# EAGLE design TaHTestbed (EAGLE 6.5.0)
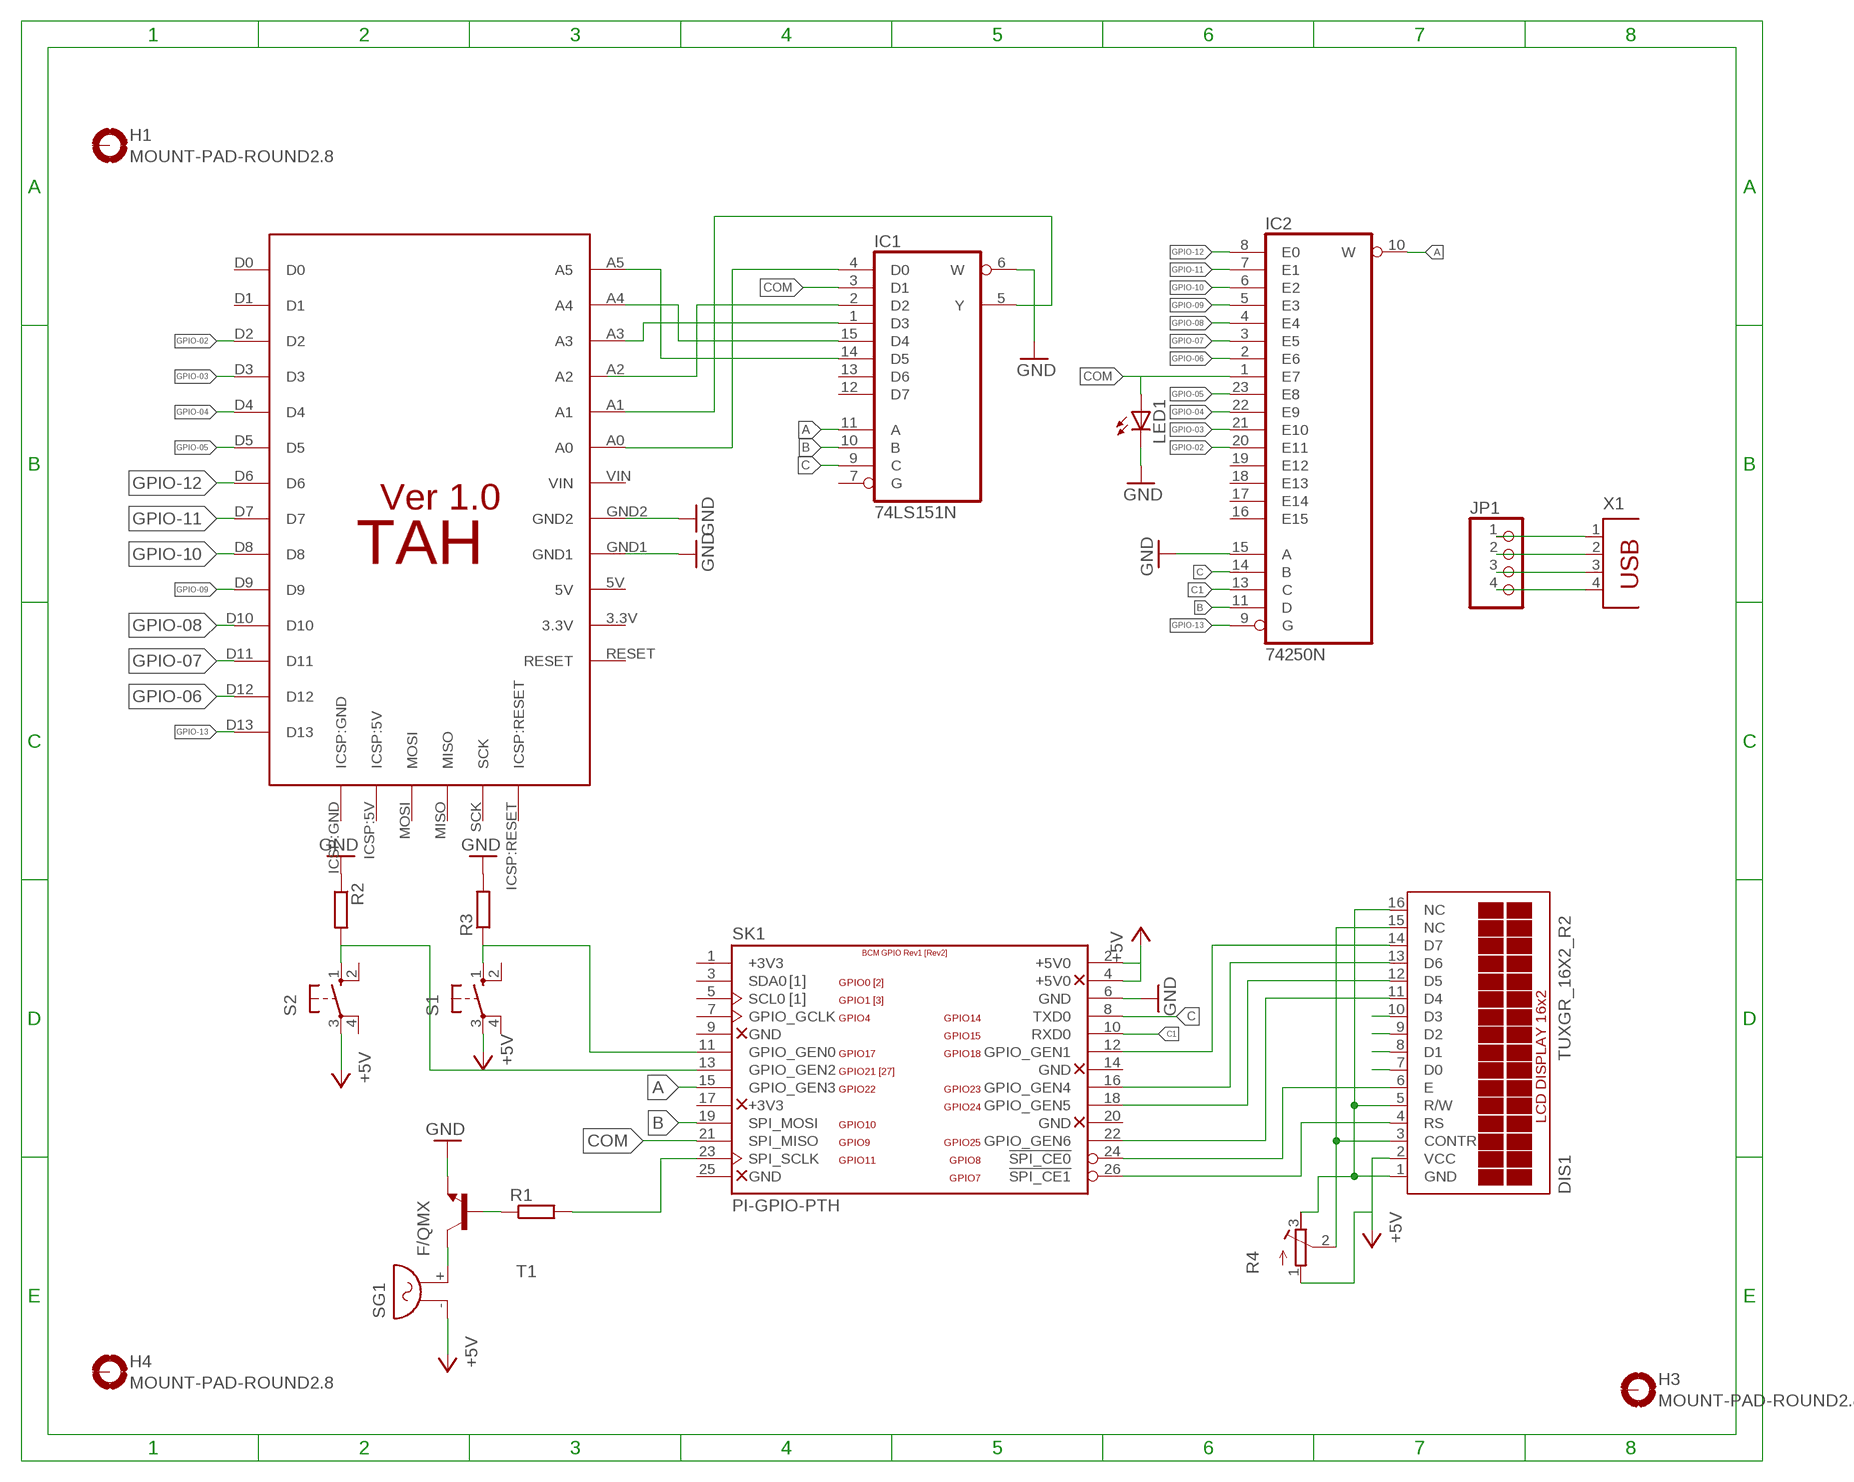
[diagram p0: schematic, sheet 1]

## Parts
DIS1  TUXGR_16X2_R2  [TUXGR_16X2_R2]
H1  MOUNT-PAD-ROUND2.8  [2,8-PAD]
H3  MOUNT-PAD-ROUND2.8  [2,8-PAD]
H4  MOUNT-PAD-ROUND2.8  [2,8-PAD]
IC1  74LS151N  [DIL16]
IC2  74250N  [DIL24-6]
JP1  PINHD-1X4  [1X04]
LED1  LEDCHIPLED_1206  [CHIPLED_1206]
R1  R-EU_0207/10  [0207/10]
R2  R-EU_0613/5V  [P0613V]
R3  R-EU_0613/5V  [P0613V]
R4  R-TRIMM64Z  [RTRIM64Z]
S1  10-XX  [B3F-10XX]
S2  10-XX  [B3F-10XX]
SG1  F/QMX  [F/QMX]
SK1  PI-GPIO-PTH  [GPIO-CONNECTOR]
T1  BC547-NPN-TO92-CBE  [TO92-CBE]
U$2  TAH_FOOTPRINT_VER1.0  [TAH_FOOTPRINT]
X1  PN87520  [PN87520]

## Nets
+5V: DIS1.2(VCC) R4.1(A) S1.3(P) S2.3(P) SG1.- SK1.2(+5V0) SK1.4(+5V0)
A: IC1.11(A) IC2.10(W) SK1.15(GPIO_GEN3)
B: IC1.10(B) IC2.11(D) SK1.19(SPI_MOSI)
C: IC1.9(C) IC2.14(B) SK1.8(TXD0)
C1: IC2.13(C) SK1.10(RXD0)
CM_IN: IC1.4(D0) U$2.A0
COM: IC1.3(D1) IC2.1(E7) LED1.A SK1.21(SPI_MISO)
GND: IC1.6(W) IC2.15(A) LED1.C R2.1 R3.2 SK1.6(GND) T1.E U$2.GND1 U$2.GND2
GPIO-02: IC2.20(E11) U$2.D2
GPIO-03: IC2.21(E10) U$2.D3
GPIO-04: IC2.22(E9) U$2.D4
GPIO-05: IC2.23(E8) U$2.D5
GPIO-06: IC2.2(E6) U$2.D12
GPIO-07: IC2.3(E5) U$2.D11
GPIO-08: IC2.4(E4) U$2.D10
GPIO-09: IC2.5(E3) U$2.D9
GPIO-10: IC2.6(E2) U$2.D8
GPIO-11: IC2.7(E1) U$2.D7
GPIO-12: IC2.8(E0) U$2.D6
GPIO-13: IC2.9(G) U$2.D13
N$1: IC1.14(D5) U$2.A5
N$2: IC1.15(D4) U$2.A4
N$3: IC1.1(D3) U$2.A3
N$4: DIS1.4(RS) SK1.26(!SPI_CE1)
N$5: IC1.2(D2) U$2.A2
N$6: DIS1.6(E) SK1.24(!SPI_CE0)
N$7: DIS1.7(D0)
N$8: DIS1.8(D1)
N$9: DIS1.9(D2)
N$10: DIS1.10(D3)
N$11: DIS1.11(D4) SK1.22(GPIO_GEN6)
N$12: DIS1.12(D5) SK1.18(GPIO_GEN5)
N$13: DIS1.13(D6) SK1.16(GPIO_GEN4)
N$14: DIS1.14(D7) SK1.12(GPIO_GEN1)
N$15: JP1.1 X1.1
N$16: IC1.5(Y) U$2.A1
N$17: DIS1.1(GND) DIS1.5(R/W) DIS1.16(NC) R4.3(E)
N$18: R1.2 SK1.23(SPI_SCLK)
N$19: R1.1 T1.B
N$20: DIS1.3(CONTR) DIS1.15(NC) R4.2(S)
N$21: SG1.+ T1.C
N$22: R3.1 S1.1(S) SK1.11(GPIO_GEN0)
N$23: R2.2 S2.1(S) SK1.13(GPIO_GEN2)
N$25: JP1.2 X1.2
N$26: JP1.3 X1.3
N$27: JP1.4 X1.4
Unconnected: H1.B2,8(MOUNT) H3.B2,8(MOUNT) H4.B2,8(MOUNT) IC1.7(G) IC1.12(D7) IC1.13(D6) IC2.16(E15) IC2.17(E14) IC2.18(E13) IC2.19(E12) S1.2(S1) S1.4(P1) S2.2(S1) S2.4(P1) SK1.3(SDA0) SK1.5(SCL0) SK1.7(GPIO_GCLK) SK1.9(GND) SK1.14(GND) SK1.17(+3V3) SK1.20(GND) SK1.25(GND) U$2.3.3V U$2.5V U$2.D0 U$2.D1 U$2.ICSP:5V U$2.ICSP:GND U$2.ICSP:RESET U$2.MISO U$2.MOSI U$2.RESET U$2.SCK U$2.VIN

## Power pins joined to a net without a drawn wire
+3V3: SK1.1(+3V3)
GND: IC1.8(GND) IC2.12(GND)
VCC: IC1.16(VCC) IC2.24(VCC)

## Library data of the parts
DIS1 = display-lcd:TUXGR_16X2_R2: Tuxgraphics LCD display 16x2 characters reflective, without background light Source: tuxgr_12x2_r2.pdf; OC_FARNELL: unknown; OC_NEWARK: unknown
H1 H3 H4 = holes:MOUNT-PAD-ROUND: MOUNTING PAD, round
IC1 = 74xx-eu:74*151: Data SELECTOR/MULTIPLEXER
IC2 = 74xx-eu:74*250: 1 of 16 data GENERATOR/MULTIPLEXER, 3-state
JP1 = pinhead:PINHD-1X4: PIN HEADER
LED1 = led:LED: LED OSRAM: - CHIPLED LG R971, LG N971, LY N971, LG Q971, LY Q971, LO R971, LY R971 LH N974, LH R974 LS Q976, LO Q976, LY Q976 LO Q996 - Hyper CHIPLED LW Q18S LB Q993, LB Q99A, LB R99A - SideLED LS A670, LO A670, LY A670, LG A670, LP A670 LB A673, LV A673, LT A673, LW A673 LH A674 LY A675 LS A676, LA A676, LO A676, LY A676, LW A676 LS A679, LY A679, LG A679 - Hyper Micro SIDELED® LS Y876, LA Y876, LO Y876, LY Y876 LT Y87S - SmartLED LW L88C, LW L88S LB L89C, LB L89S, LG L890 LS L89K, LO L89K, LY L89K LS L896, LA L896, LO L896, LY L896 - TOPLED LS T670, LO T670, LY T670, LG T670, LP T670 LSG T670, LSP T670, LSY T670, LOP T670, LYG T670 LG T671, LOG T671, LSG T671 LB T673, LV T673, LT T673, LW T673 LH T674 LS T676, LA T676, LO T676, LY T676, LB T676, LH T676, LSB T676, LW T676 LB T67C, LV T67C, LT T67C, LS T67K, LO T67K, LY T67K, LW E67C LS E67B, LA E67B, LO E67B, LY E67B, LB E67C, LV E67C, LT E67C LW T67C LS T679, LY T679, LG T679 LS T770, LO T770, LY T770, LG T770, LP T770 LB T773, LV T773, LT T773, LW T773 LH T774 LS E675, LA E675, LY E675, LS T675 LS T776, LA T776, LO T776, LY T776, LB T776 LHGB T686 LT T68C, LB T68C - Hyper Mini TOPLED® LB M676 - Mini TOPLED Santana® LG M470 LS M47K, LO M47K, LY M47K Source: http://www.osram.convergy.de LUXEON: - LUMILED® LXK2-PW12-R00, LXK2-PW12-S00, LXK2-PW14-U00, LXK2-PW14-V00 LXK2-PM12-R00, LXK2-PM12-S00, LXK2-PM14-U00 LXK2-PE12-Q00, LXK2-PE12-R00, LXK2-PE12-S00, LXK2-PE14-T00, LXK2-PE14-U00 LXK2-PB12-K00, LXK2-PB12-L00, LXK2-PB12-M00, LXK2-PB14-N00, LXK2-PB14-P00, LXK2-PB14-Q00 LXK2-PR12-L00, LXK2-PR12-M00, LXK2-PR14-Q00, LXK2-PR14-R00 LXK2-PD12-Q00, LXK2-PD12-R00, LXK2-PD12-S00 LXK2-PH12-R00, LXK2-PH12-S00 LXK2-PL12-P00, LXK2-PL12-Q00, LXK2-PL12-R00 Source: www.luxeon.com KINGBRIGHT: KA-3528ASYC Source: www.kingbright.com
R1-R3 = rcl:R-EU_: RESISTOR, European symbol
R4 = rcl:R-TRIMM: Trimm resistor
S1 S2 = switch-omron:10-XX: OMRON SWITCH; MPN: B3F-1000; OC_FARNELL: 176432; OC_NEWARK: 36M3542
SG1 = buzzer:F/QMX: BUZZER Source: Buerklin; OC_FARNELL: unknown; OC_NEWARK: unknown
SK1 = Raspberry-pi:PI-: Raspberry Pi
T1 = transistor:*-NPN-: NPN Transistror BF959 corrected 2008.03.06
U$2 = TAHNew:TAH_FOOTPRINT_VER1.0
X1 = con-berg:PN87520: BERG USB connector; OC_FARNELL: unknown; OC_NEWARK: unknown

## Board
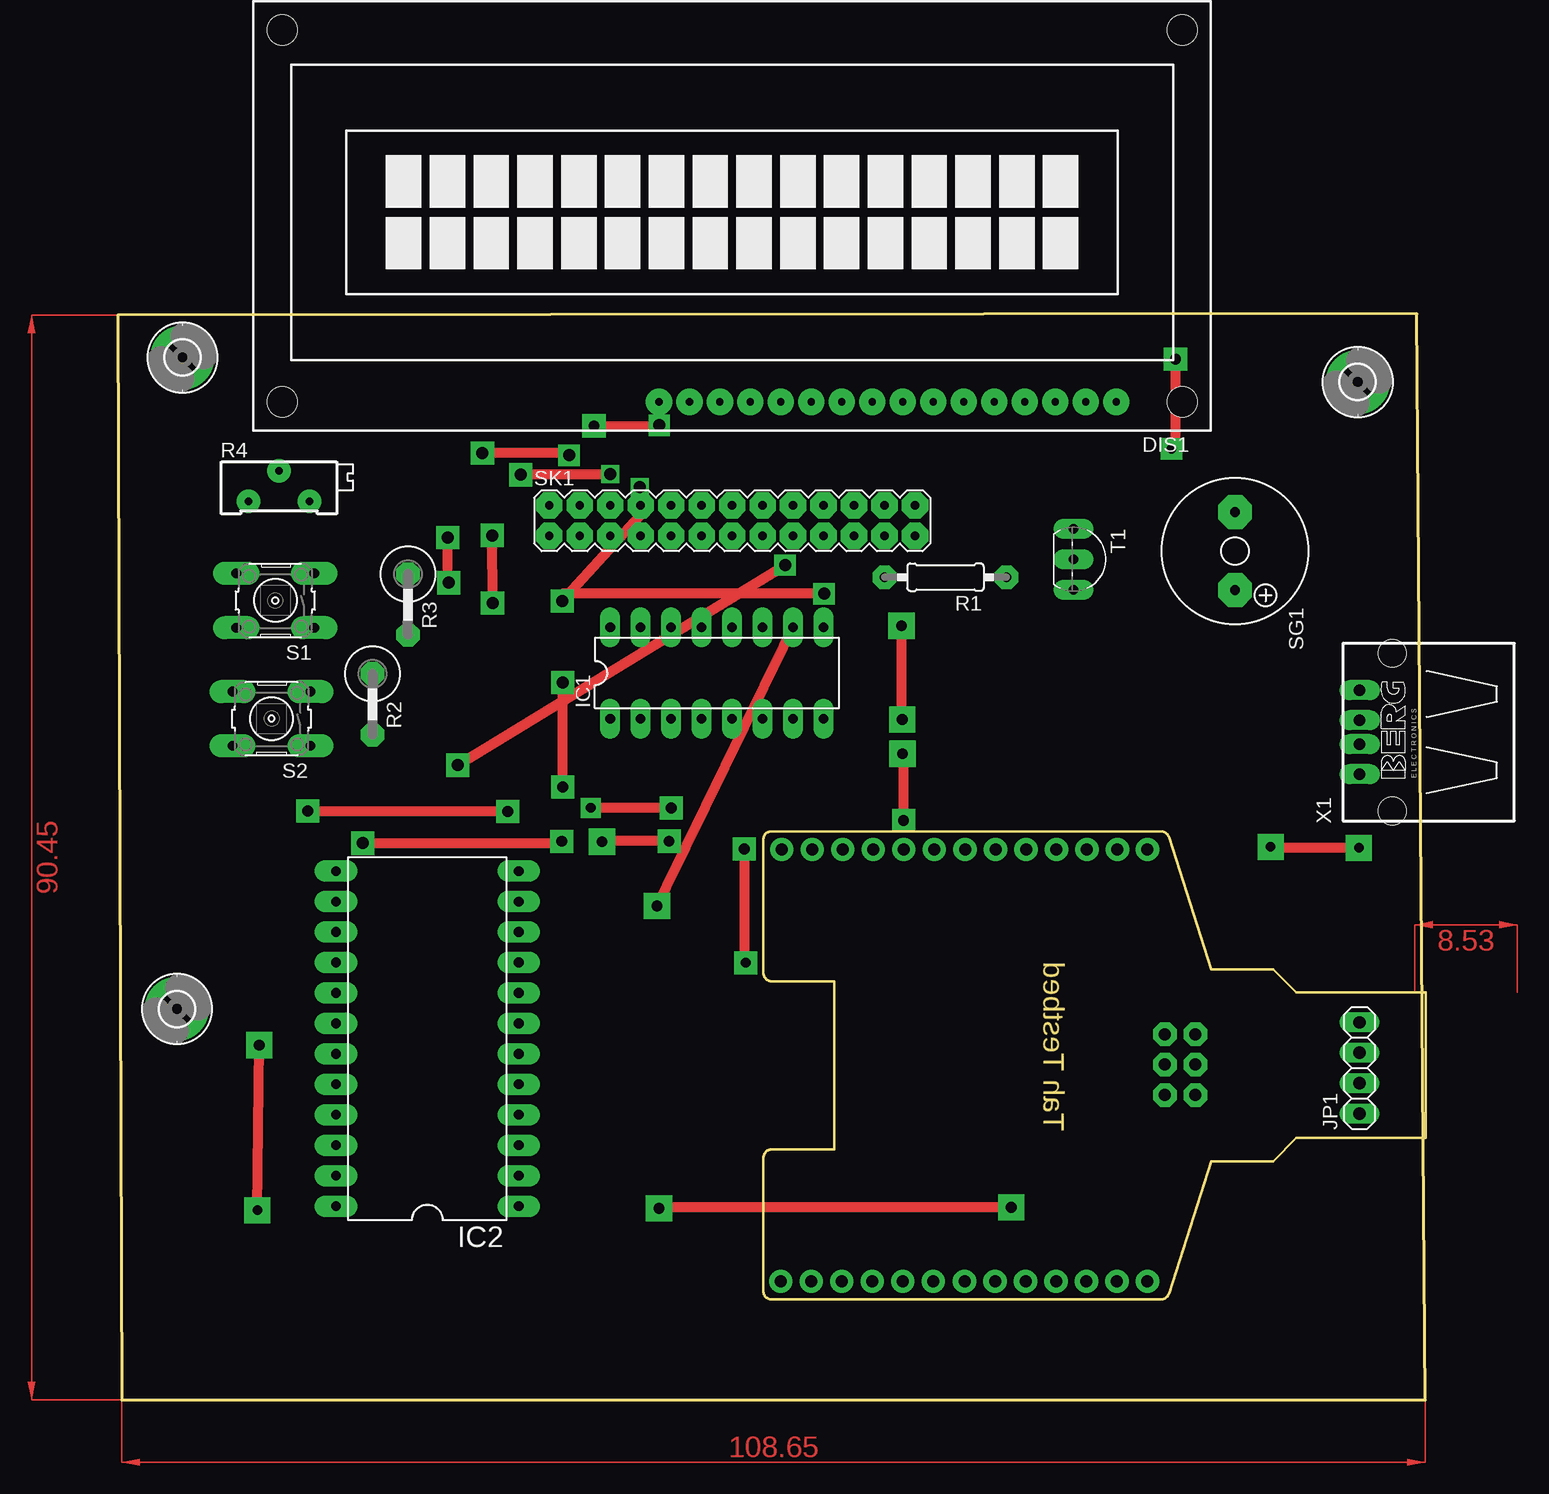
[diagram p1: board, top side]
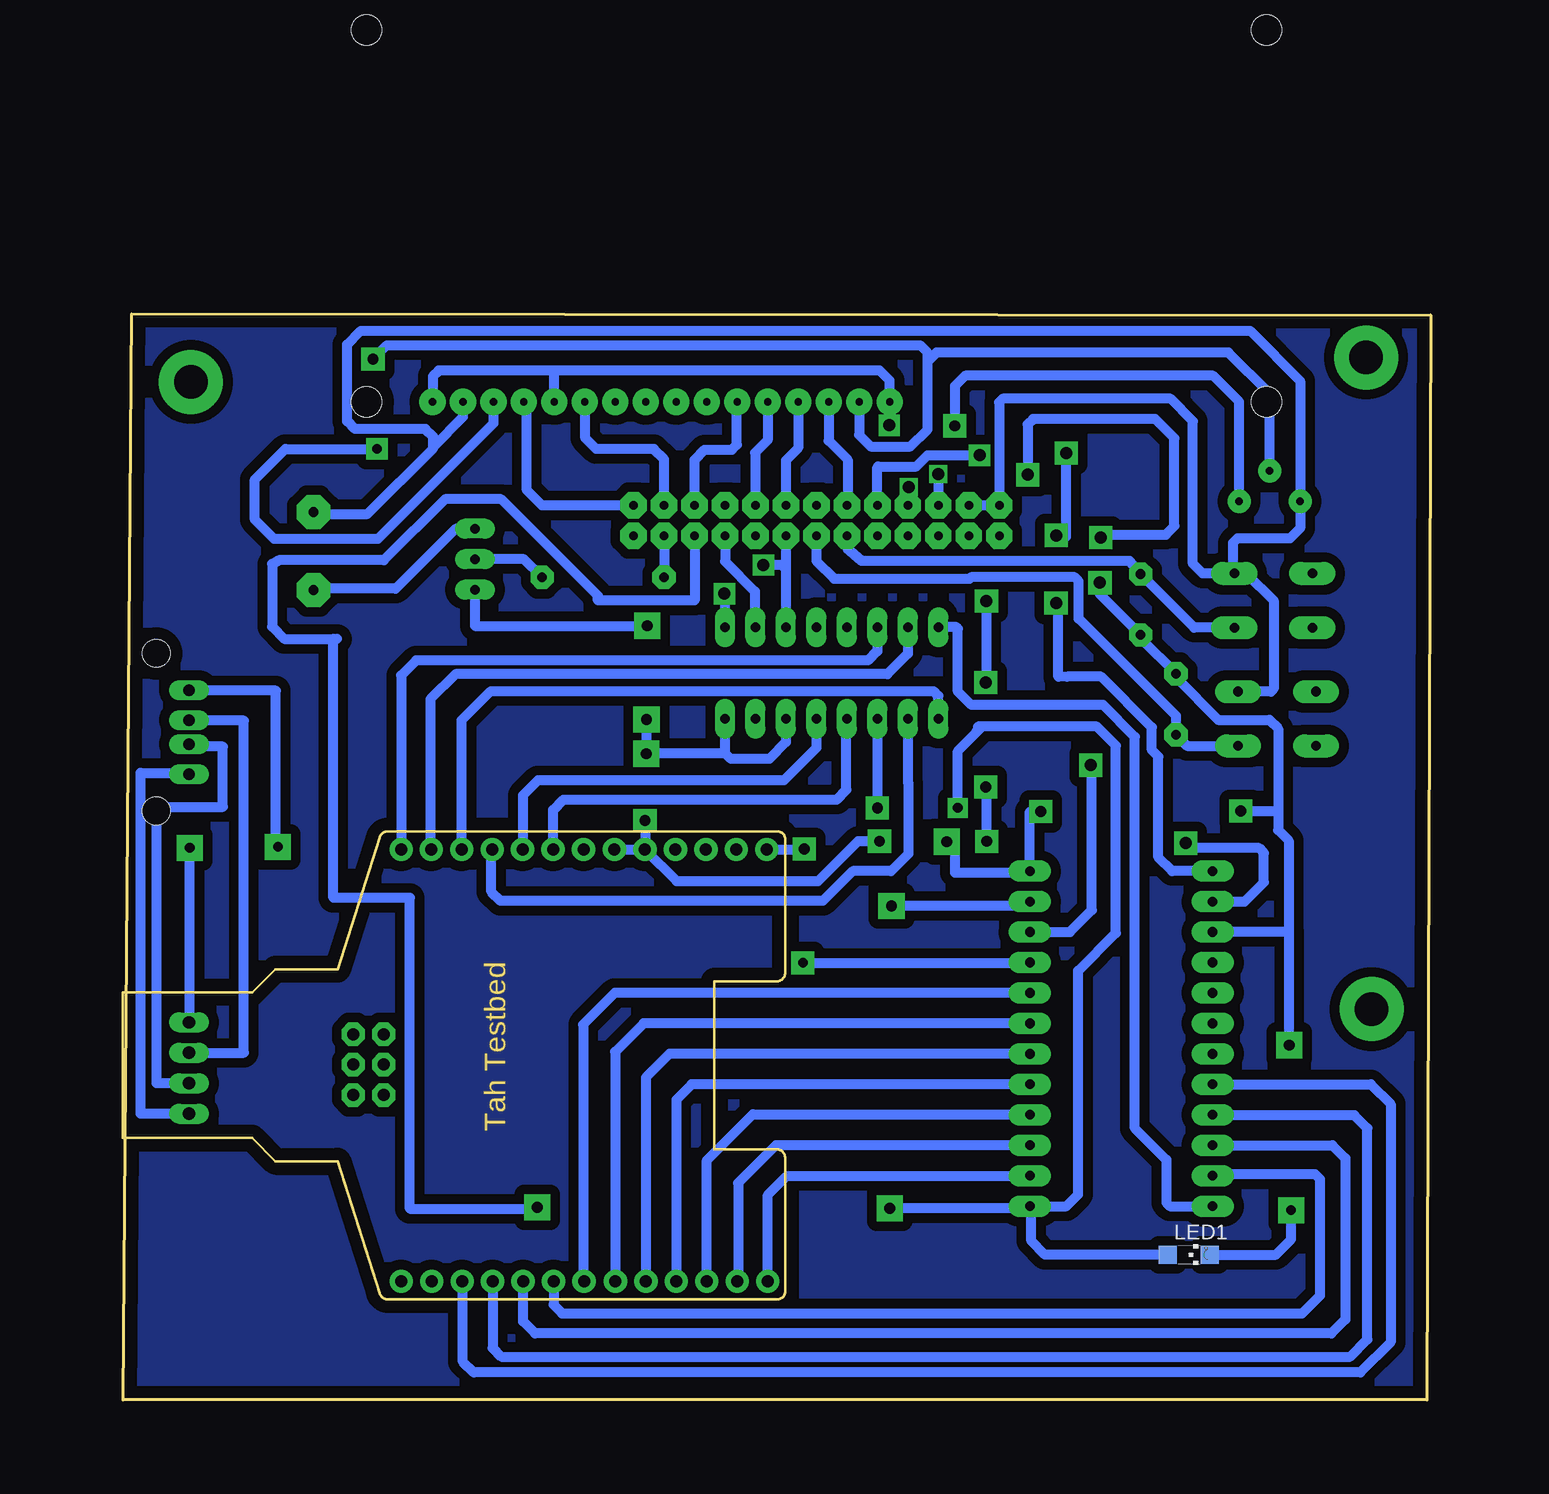
[diagram p2: board, bottom side, seen from below]

Size 109.01 x 90.54 mm. Coordinates in mm from the lower left corner, seen from the top.
Outline: 0.31,0 108.96,0.01 108.25,90.54 0,90.45 0.31,0
Copper layers (1*16): Top 0.035mm / dielectric 1.5mm / Bottom 0.035mm
Design rules "default": minimum track width 10mil, minimum drill 24mil, track to track 8mil, track to pad 8mil, pad to pad 8mil, via to via 8mil, smd to smd 8mil, copper to edge 40mil, drill to drill 8mil, minimum pad ring 10mil, minimum via ring 8mil, stop-mask expansion 4mil, vias tented up to drill 0mil, thermal gap 10mil

### Footprints (pad centres in the part's own frame; a part is rotated, then mirrored left to right if it is on the bottom)
TUXGR_16X2_R2 = drill 0.6 pad 2.184: 1 -32,15.5; 2 -29.46,15.5; 3 -26.92,15.5; 4 -24.38,15.5; 5 -21.84,15.5; 6 -19.3,15.5; 7 -16.76,15.5; 8 -14.22,15.5; 9 -11.68,15.5; 10 -9.14,15.5; 11 -6.6,15.5; 12 -4.06,15.5; 13 -1.52,15.5; 14 1.02,15.5; 15 3.56,15.5; 16 6.1,15.5 | hole 2.5: -37.5,-15.5; 37.5,-15.5; -37.5,15.5; 37.5,15.5
2,8-PAD = drill 2.8 pad 5.334: B2,8 0,0
DIL16 = drill 0.8 pad 1.676 long: 1 -8.89,-3.81; 2 -6.35,-3.81; 3 -3.81,-3.81; 4 -1.27,-3.81; 5 1.27,-3.81; 6 3.81,-3.81; 7 6.35,-3.81; 8 8.89,-3.81; 9 8.89,3.81; 10 6.35,3.81; 11 3.81,3.81; 12 1.27,3.81; 13 -1.27,3.81; 14 -3.81,3.81; 15 -6.35,3.81; 16 -8.89,3.81
DIL24-6 = drill 0.8 pad 1.778 long: 1 -13.97,-7.62; 2 -11.43,-7.62; 3 -8.89,-7.62; 4 -6.35,-7.62; 5 -3.81,-7.62; 6 -1.27,-7.62; 7 1.27,-7.62; 8 3.81,-7.62; 9 6.35,-7.62; 10 8.89,-7.62; 11 11.43,-7.62; 12 13.97,-7.62; 13 13.97,7.62; 14 11.43,7.62; 15 8.89,7.62; 16 6.35,7.62; 17 3.81,7.62; 18 1.27,7.62; 19 -1.27,7.62; 20 -3.81,7.62; 21 -6.35,7.62; 22 -8.89,7.62; 23 -11.43,7.62; 24 -13.97,7.62
1X04 = drill 1.016 pad 1.676 long: 1 -3.81,0; 2 -1.27,0; 3 1.27,0; 4 3.81,0
CHIPLED_1206 = smd 1.5 x 1.5: A 0,-1.75; C 0,1.75
0207/10 = drill 0.8 pad 1.93 octagon: 1 -5.08,0; 2 5.08,0
P0613V = drill 0.8 pad 1.93 octagon: 1 -2.54,0; 2 2.54,0
RTRIM64Z = drill 0.61 pad 1.93: 1 0,-2.54; 2 -2.54,0; 3 0,2.54
B3F-10XX = drill 0.8 pad 1.93 long: 1 -3.251,2.261; 2 3.251,2.261; 3 -3.251,-2.261; 4 3.251,-2.261
F/QMX = drill 0.8 pad 2.8 octagon: + 3.251,0; - -3.251,0
GPIO-CONNECTOR = drill 0.7 pad 2.184 octagon: 1 -15.24,-1.27; 2 -15.24,1.27; 3 -12.7,-1.27; 4 -12.7,1.27; 5 -10.16,-1.27; 6 -10.16,1.27; 7 -7.62,-1.27; 8 -7.62,1.27; 9 -5.08,-1.27; 10 -5.08,1.27; 11 -2.54,-1.27; 12 -2.54,1.27; 13 0,-1.27; 14 0,1.27; 15 2.54,-1.27; 16 2.54,1.27; 17 5.08,-1.27; 18 5.08,1.27; 19 7.62,-1.27; 20 7.62,1.27; 21 10.16,-1.27; 22 10.16,1.27; 23 12.7,-1.27; 24 12.7,1.27; 25 15.24,-1.27; 26 15.24,1.27
TO92-CBE = drill 0.8 pad 1.676 long: B 0,0; C -2.54,0; E 2.54,0
TAH_FOOTPRINT = drill 1 pad 1.93: 3.3V 1.5,48.8; 5V 1.5,46.26; A0 1.5,36.06; A1 1.5,33.52; A2 1.5,30.98; A3 1.5,28.44; A4 1.5,25.9; A5 1.5,23.4; D0 37.5,23.4; D1 37.5,25.94; D2 37.5,28.48; D3 37.5,31.02; D4 37.5,33.56; D5 37.5,36.1; D6 37.5,38.64; D7 37.5,41.26; D8 37.5,43.8; D9 37.5,46.34; D10 37.5,48.88; D11 37.5,51.42; D12 37.5,53.96; D13 1.5,53.88; GND1 1.5,43.72; GND2 1.5,41.18; RESET 1.5,51.34; VIN 1.5,38.6 | drill 1 pad 1.93 octagon: ICSP:5V 16.9,21.94; ICSP:GND 21.98,21.94; ICSP:RESET 21.98,19.4; MISO 16.9,19.4; MOSI 19.44,21.94; SCK 19.44,19.4
PN87520 = drill 0.95 pad 1.676 long: 1 -3.5,2.71; 2 -1,2.71; 3 1,2.71; 4 3.5,2.71 | hole 2.3: -6.57,0; 6.57,0

### Placement (x,y rotation side)
DIS1  51.19,98.7 180 top
H1  4.92,32.6 0 top
H3  103.31,84.87 0 top
H4  5.38,86.9 0 top
IC1  49.92,60.6 0 top
IC2  25.79,30.12 90 top
JP1  103.47,27.68 90 top
LED1  20.14,12.11 270 bottom
R1  68.97,68.58 180 top
R2  21.22,58 270 top
R3  24.17,66.31 270 top
R4  13.42,74.91 270 top
S1  13.11,66.64 180 top
S2  12.8,56.79 180 top
SG1  93.1,70.76 270 top
SK1  51.19,73.3 0 top
T1  79.64,70.09 270 top
U$2  109.2,47.4 270 bottom
X1  106.19,55.67 90 top

### Tracks (layer width: path | path; a pad name or v marks a point on that pad's centre or on a via)
+5V
  Bottom 0.813: S1.3 16.48,69.02 16.48,71.43 16.11,71.81 11.74,71.81 10.88,72.67 R4.1 10.87,74.92 10.87,84.94 15.05,89.12 89.16,89.12 90.3,87.98 90.3,81.59 89.66,80.95 83.77,80.95 83.14,80.32 83.14,79.45 | S1.3 15.35,68.9 13.09,66.65 13.09,59.28 13.32,59.05 S2.3 | S1.3 19,68.9 19.81,69.71 19.81,81.59 21.67,83.46 35.66,83.46 35.95,83.17 SK1.2 SK1.4 | SG1.- 92.94,73.86 88.6,73.86 83.14,79.32 83.14,79.45 | DIS1.2 80.65,81.94 83.14,79.45
A  (via drill 1 pad 1.78, 1 pad 1.93)
  Top 0.813: v28.33,52.91 v55.6,69.6
  Bottom 0.813: IC2.10 30.06,39.01 28.23,40.84 28.23,52.82 v28.33,52.91 | SK1.15 IC1.11 53.71,64.43 53.71,69.22 54.09,69.6 v55.6,69.6
B  (via drill 0.9 pad 2.18)
  Top 0.813: v44.93,41.18 IC1.10
  Bottom 0.813: SK1.19 58.81,69.91 56.31,67.41 56.31,64.46 IC1.10 | IC2.11 33.41,41.18 v44.93,41.18 44.84,41.17
C  (via drill 0.9 pad 1.93, 1 pad 1.42, 1 pad 1.78, 1 pad 1.93)
  Top 0.813: v58.85,67.21 37.03,67.21 v37.02,66.6 43.5,73.7 v43.5,76.1 | v20.4,46.42 36.84,46.42 v37,46.57 | v37.07,51.1 37.07,59.8 v37.08,59.82
  Bottom 0.813: IC1.9 58.81,67.16 v58.85,67.21 | v37.02,66.6 37.02,59.88 v37.08,59.82 | IC2.14 15.5,41.55 13.89,43.16 13.89,45.59 14.3,46 19.99,46 v20.4,46.42 | v37,46.57 37,51.02 v37.07,51.1 | SK1.8 43.57,76.04 v43.5,76.1
C1  (via drill 1 pad 1.78, 1 pad 1.93)
  Top 0.813: v31.22,66.43 v31.21,72.07 | v37.59,78.75 37.41,78.93 v30.38,78.93
  Bottom 0.813: 46.26,74.72 SK1.10 46.11,77.76 46.05,77.82 42.86,77.82 41.93,78.75 v37.59,78.75 | IC2.13 21.55,44.09 22.69,45.23 22.69,53.63 23.23,54.18 23.23,56.07 27.46,60.3 30.3,60.3 31.03,60.28 31.03,66.27 v31.22,66.43 | v31.21,72.07 30.38,71.94 v30.38,78.93 30.38,79.03
CM_IN
  Bottom 0.813: U$2.A0 73.14,49.2 72.28,50.06 49.5,50.06 48.68,50.88 48.68,56.76 IC1.4
COM  (via drill 0.8 pad 1.68, 0.9 pad 1.93, 0.9 pad 2.18)
  Top 0.813: v46.11,49.36 v39.41,49.36 | v74.44,16.06 45.09,16.06 v45.09,15.98
  Bottom 0.813: 37.38,56.12 27.81,56.12 26.23,54.54 26.23,38.91 29.37,35.77 29.37,17.14 30.36,16.15 IC2.1 | 37.38,56.12 37.73,56.12 37.73,55.79 37.88,55.64 37.88,55.67 37.64,55.91 37.64,55.93 | SK1.21 61.35,66.66 69.41,66.66 69.41,67.04 77.45,75.09 82.13,75.09 87.22,70 95.99,70 96.54,69.7 96.54,64.45 95.52,63.43 91.45,63.43 | IC2.1 33.28,16.03 33.28,13.25 32.14,12.11 LED1.A | IC2.1 33.41,15.98 v45.09,15.98 | IC1.3 v46.11,49.36 | v39.41,49.36 39.41,54.09 37.38,56.12 | 91.45,63.43 91.12,63.43 | v74.44,16.06 74.44,15.94 85.06,15.94 85.06,41.85 91.45,41.85 91.45,63.43
GND  (via drill 0.8 pad 2.18, 0.9 pad 1.93, 0.9 pad 2.18, 1, 1 pad 1.93)
  Top 0.813: v27.56,68.13 27.5,68.19 v27.5,71.88 | v33.58,77.12 33.65,77.19 v41.03,77.19 | v11.62,15.81 v11.79,29.58 | v65.47,48.32 65.47,53.87 v65.38,53.87 | v65.29,64.53 65.29,56.72 v65.35,56.72 | v32.5,49.05 15.82,49.05 v15.82,49.11 | v45.93,46.58 40.33,46.58 v40.33,46.53
  Bottom 0.813: v27.56,68.13 27.56,67.16 R3.2 24.17,63.49 R2.1 21.22,60.21 17.71,56.7 13.44,56.7 12.71,55.96 12.71,49.11 | v27.5,71.88 27.24,72.14 22.06,72.14 21.35,72.85 21.35,80.17 22.97,81.78 33.13,81.78 33.58,81.33 v33.58,77.12 | v41.03,77.19 | v41.03,77.19 SK1.6 | IC1.6 53.73,54.83 55.1,53.45 58.32,53.45 58.81,53.94 | 58.81,53.94 IC1.8 | LED1.C 12.91,12.11 11.62,13.39 v11.62,15.81 | v11.79,29.58 11.79,39.01 | 11.79,39.01 IC2.15 | 12.71,49.11 12.71,47.51 11.84,46.64 11.84,39.06 11.79,39.01 | U$2.GND2 U$2.GND1 | v65.48,48.32 v65.47,48.32 65.46,48.32 65.46,45.91 U$2.GND1 | 58.81,53.94 65.38,53.94 v65.38,53.87 65.35,53.87 v65.35,56.72 | T1.E 79.64,64.53 v65.29,64.53 | v32.5,49.05 33.41,49.05 IC2.12 33.41,43.97 39.66,43.97 39.66,46.53 v40.33,46.53 | v15.82,49.11 12.71,49.11 | U$2.GND1 62.83,43.25 51.05,43.25 47.72,46.58 v45.93,46.58
GPIO-02
  Bottom 0.813: IC2.20 4.98,26.31 3.33,24.67 3.33,4.83 5.86,2.29 79.74,2.29 80.65,3.2 80.65,9.83 U$2.D2
GPIO-03
  Bottom 0.813: U$2.D3 78.18,4.34 77.45,3.62 6.71,3.62 5.28,5.05 5.28,22.66 6.37,23.74 18.13,23.74 IC2.21
GPIO-04
  Bottom 0.813: IC2.22 8.2,21.23 7.12,20.15 7.12,6.72 8.28,5.55 74.63,5.55 75.63,6.55 U$2.D4
GPIO-05
  Bottom 0.813: U$2.D5 73.1,7.93 72.38,7.22 10.71,7.22 9.2,8.72 9.2,18.4 9.62,18.82 18.04,18.82 IC2.23
GPIO-06
  Bottom 0.813: U$2.D12 55.24,17.08 53.65,18.66 33.43,18.66 IC2.2
GPIO-07
  Bottom 0.813: IC2.3 54.56,21.23 57.71,18.09 57.71,9.96 U$2.D11
GPIO-08
  Bottom 0.813: U$2.D10 60.32,19.99 56.49,23.82 33.45,23.82 IC2.4
GPIO-09
  Bottom 0.813: IC2.5 61.58,26.31 62.86,25.04 U$2.D9
GPIO-10
  Bottom 0.813: IC2.6 63.44,28.85 65.41,26.89 65.41,9.91 U$2.D8
GPIO-11
  Bottom 0.813: IC2.7 65.6,31.39 67.96,29.03 67.96,9.92 U$2.D7
GPIO-12
  Bottom 0.813: IC2.8 67.98,33.93 70.62,31.29 70.62,9.96 U$2.D6
GPIO-13  (via drill 0.8 pad 1.93, 0.9 pad 1.93)
  Top 0.813: v52.21,45.94 52.21,36.56 v52.32,36.45
  Bottom 0.813: v52.32,36.45 33.43,36.45 IC2.9 | U$2.D13 52.25,45.9 v52.21,45.94
N$1
  Bottom 0.813: IC1.14 46.11,62.42 46.87,61.65 84.54,61.65 85.79,60.4 U$2.A5
N$2
  Bottom 0.813: IC1.15 43.57,62.22 45.28,60.5 81.26,60.5 83.35,58.41 83.35,45.95 U$2.A4
N$3
  Bottom 0.813: U$2.A3 80.76,56.67 78.33,59.1 41.42,59.1 41.02,58.7 41.03,58.69 IC1.1
N$4
  Bottom 0.813: SK1.26 74.05,74.57 75.32,75.84 75.32,82.95 DIS1.4
N$5
  Bottom 0.813: IC1.2 43.57,51.46 43.53,51.43 43.53,45.53 44.97,44.09 48.15,44.09 50.64,41.6 77.51,41.6 78.27,42.35 78.27,45.84 U$2.A2
N$6
  Bottom 0.813: SK1.24 63.89,78.42 64.74,79.27 69.55,79.27 70.44,80.16 70.44,83.16 DIS1.6
N$11
  Bottom 0.813: SK1.22 61.35,78.38 60.52,79.21 58.22,79.21 57.81,79.62 57.81,83.18 DIS1.11
N$12
  Bottom 0.813: DIS1.12 55.25,80.01 56.29,78.97 56.29,74.59 SK1.18
N$13
  Bottom 0.813: DIS1.13 52.71,79.35 53.74,78.32 53.74,74.59 SK1.16
N$14
  Bottom 0.813: DIS1.14 50.17,79.95 48.58,78.37 48.58,74.64 SK1.12
N$15
  Bottom 0.813: JP1.1 107.5,23.87 107.5,52.29 103.48,52.29 X1.1
N$16
  Bottom 0.813: IC1.5 51.19,54.36 53.89,51.65 74.4,51.65 75.65,50.39 75.65,45.92 U$2.A1
N$17  (via drill 0.9 pad 1.93, 1 pad 1.78)
  Top 0.813: v39.67,81.2 45.16,81.2 v45.12,81.25
  Bottom 0.813: 73.03,85.82 45.93,85.82 45.09,84.98 DIS1.16 45,83.29 45,81.2 | 73.03,85.82 82.67,85.82 83.15,85.34 83.15,83.24 DIS1.1 | DIS1.5 73.03,85.82 | v45.12,81.25 45,81 45,81.2 | R4.3 15.96,83.22 18.12,85.38 38.79,85.38 39.64,84.53 39.64,81.23 v39.67,81.2 | 45,81.2 45.04,81.24 45.04,81.27 45.06,81.28
N$18
  Bottom 0.813: SK1.23 R1.2
N$19
  Bottom 0.813: R1.1 75.56,70.09 T1.B
N$20  (via drill 0.8 pad 1.78, 0.9 pad 1.93)
  Top 0.813: v87.8,79.27 88.14,79.61 v88.14,86.75
  Bottom 0.813: DIS1.3 78.11,81.4 87.73,71.77 96.38,71.77 97.98,73.38 97.98,76.73 95.44,79.27 v87.8,79.27 | 41.93,86.55 41.93,80.91 43.36,79.48 46.66,79.48 47.63,80.44 DIS1.15 | 41.93,86.55 41.93,87.3 42.54,87.92 86.98,87.92 v88.14,86.75 | R4.2 13.42,83.87 16.87,87.32 41.17,87.32 41.93,86.55
N$21
  Bottom 0.813: T1.C 81.24,72.63 86.25,67.62 92.98,67.62 SG1.+
N$22
  Bottom 0.813: S1.1 19.7,64.38 R3.1 25.11,69.95 47.42,69.95 48.65,71.02 SK1.11
N$23
  Bottom 0.813: S2.1 20.29,54.53 R2.2 21.22,57.02 29.33,65.14 29.33,68.25 29.68,68.6 38.3,68.6 38.43,68.47 49.7,68.47 51.19,69.95 SK1.13
N$25
  Bottom 0.813: JP1.2 106.16,26.41 106.16,49.45 100.65,49.45 100.65,54.46 103.48,54.46 X1.2
N$26
  Bottom 0.813: JP1.3 98.9,28.95 98.9,56.63 103.48,56.63 X1.3
N$27  (via drill 0.8 pad 2.18)
  Top 0.813: v103.41,46.03 96.07,46.03 v96.07,46.11
  Bottom 0.813: JP1.4 103.41,31.49 v103.41,46.03 | v96.07,46.11 96.23,46.11 96.23,59.13 103.48,59.13 X1.4
N$28
  pour Bottom (isolate 0.813): 0.16,90.3 0.16,0.17 108.73,0.17 108.73,90.32 0.22,90.32
VCC
  Bottom 0.813: IC1.16 39.5,64.41 39.4,64.31 39.4,59.05 38.28,57.93 27.31,57.93 24.65,55.28 24.65,22.64 22.03,20.02 22.03,16.45 21.73,16.15 IC2.24
(copper drawn outside any net)
  shapes: Top area x3

### Text on the board
Dimension: Tah Testbed